# EAGLE design LNInterface (EAGLE 8.3.1)
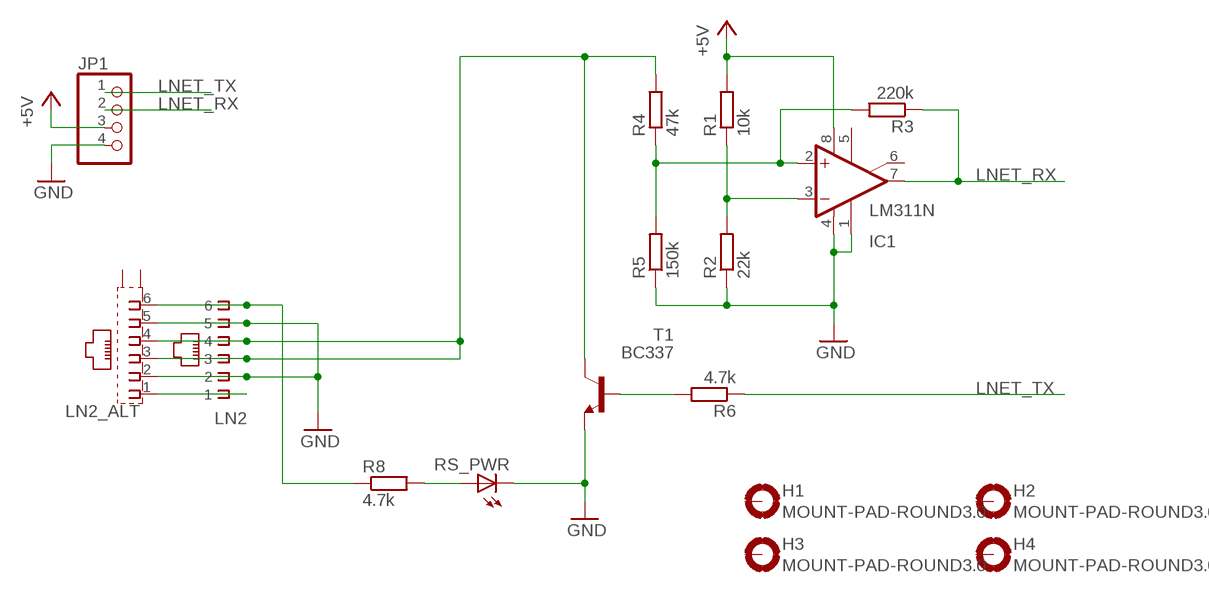
[diagram p0: schematic, sheet 1]

## Parts
H1  MOUNT-PAD-ROUND3.0  [3,0-PAD]
H2  MOUNT-PAD-ROUND3.0  [3,0-PAD]
H3  MOUNT-PAD-ROUND3.0  [3,0-PAD]
H4  MOUNT-PAD-ROUND3.0  [3,0-PAD]
IC1  LM311N  [DIL08]
JP1  PINHD-1X4  [1X04]
LN2  RJ11-6X  [RJ11-NO_SHIELD]
LN2_ALT  YH-55-10  [YH-55-10]
R1  10k  R-EU_0207/2V  [0207/2V]
R2  22k  R-EU_0207/2V  [0207/2V]
R3  220k  R-EU_0207/2V  [0207/2V]
R4  47k  R-EU_0207/2V  [0207/2V]
R5  150k  R-EU_0207/2V  [0207/2V]
R6  4.7k  R-EU_0207/2V  [0207/2V]
R8  4.7k  R-EU_0207/2V  [0207/2V]
RS_PWR  LED3MM  [LED3MM]
T1  BC337  [TO92]

## Nets
+5V: IC1.8(V+) JP1.3 R1.2
GND [power]: IC1.1(GND) IC1.4(V-) JP1.4 LN2.2 LN2.5 LN2_ALT.2 LN2_ALT.5 R2.1 R5.1 RS_PWR.K(C) T1.1(E)
LNET: LN2.3 LN2.4 LN2_ALT.3 LN2_ALT.4 R4.2 T1.3(C)
LNET_RX: IC1.7(OUT) JP1.2 R3.1
LNET_TX: JP1.1 R6.1
N$1: R6.2 T1.2(B)
N$3: IC1.3(-IN) R1.1 R2.2
N$5: IC1.2(+IN) R3.2 R4.1 R5.2
N$7 [power]: R8.2 RS_PWR.A
RAILSYNC_A [power]: LN2.6 LN2_ALT.6 R8.1
RAILSYNC_B [power]: LN2.1 LN2_ALT.1
Unconnected: H1.B3,0(MOUNT) H2.B3,0(MOUNT) H3.B3,0(MOUNT) H4.B3,0(MOUNT) IC1.5(ON) IC1.6(ON/STR) LN2_ALT.S1(S) LN2_ALT.S2(S)

## Library data of the parts
H1-H4 = holes:MOUNT-PAD-ROUND: MOUNTING PAD, round
IC1 = linear:LM311: COMPARATOR
JP1 = pinhead:PINHD-1X4: PIN HEADER
LN2 = con-tycoelectronics:RJ11: CORCOM Modular RJ Jacks No Shield Source: www.tycoelectronics.com .. ENG_DS_1654001_1099_RJ_L_0507.pdf; MPN: RJ11-6X; OC_FARNELL: unknown; OC_NEWARK: 16R6089
LN2_ALT = con-wenzhou-yihua:YH-55-10: RJ11 6 connects Source: YH-55-10.pdf; OC_FARNELL: unknown; OC_NEWARK: unknown
R1-R6 R8 = rcl:R-EU_: RESISTOR, European symbol
RS_PWR = led:LED: LED OSRAM: - CHIPLED LG R971, LG N971, LY N971, LG Q971, LY Q971, LO R971, LY R971 LH N974, LH R974 LS Q976, LO Q976, LY Q976 LO Q996 - Hyper CHIPLED LW Q18S LB Q993, LB Q99A, LB R99A - SideLED LS A670, LO A670, LY A670, LG A670, LP A670 LB A673, LV A673, LT A673, LW A673 LH A674 LY A675 LS A676, LA A676, LO A676, LY A676, LW A676 LS A679, LY A679, LG A679 - Hyper Micro SIDELED® LS Y876, LA Y876, LO Y876, LY Y876 LT Y87S - SmartLED LW L88C, LW L88S LB L89C, LB L89S, LG L890 LS L89K, LO L89K, LY L89K LS L896, LA L896, LO L896, LY L896 - TOPLED LS T670, LO T670, LY T670, LG T670, LP T670 LSG T670, LSP T670, LSY T670, LOP T670, LYG T670 LG T671, LOG T671, LSG T671 LB T673, LV T673, LT T673, LW T673 LH T674 LS T676, LA T676, LO T676, LY T676, LB T676, LH T676, LSB T676, LW T676 LB T67C, LV T67C, LT T67C, LS T67K, LO T67K, LY T67K, LW E67C LS E67B, LA E67B, LO E67B, LY E67B, LB E67C, LV E67C, LT E67C LW T67C LS T679, LY T679, LG T679 LS T770, LO T770, LY T770, LG T770, LP T770 LB T773, LV T773, LT T773, LW T773 LH T774 LS E675, LA E675, LY E675, LS T675 LS T776, LA T776, LO T776, LY T776, LB T776 LHGB T686 LT T68C, LB T68C - Hyper Mini TOPLED® LB M676 - Mini TOPLED Santana® LG M470 LS M47K, LO M47K, LY M47K Source: http://www.osram.convergy.de LUXEON: - LUMILED® LXK2-PW12-R00, LXK2-PW12-S00, LXK2-PW14-U00, LXK2-PW14-V00 LXK2-PM12-R00, LXK2-PM12-S00, LXK2-PM14-U00 LXK2-PE12-Q00, LXK2-PE12-R00, LXK2-PE12-S00, LXK2-PE14-T00, LXK2-PE14-U00 LXK2-PB12-K00, LXK2-PB12-L00, LXK2-PB12-M00, LXK2-PB14-N00, LXK2-PB14-P00, LXK2-PB14-Q00 LXK2-PR12-L00, LXK2-PR12-M00, LXK2-PR14-Q00, LXK2-PR14-R00 LXK2-PD12-Q00, LXK2-PD12-R00, LXK2-PD12-S00 LXK2-PH12-R00, LXK2-PH12-S00 LXK2-PL12-P00, LXK2-PL12-Q00, LXK2-PL12-R00 Source: www.luxeon.com KINGBRIGHT: KA-3528ASYC Source: www.kingbright.com
T1 = transistor:BC337: NPN TRANSISTOR

## Net classes
0 default: width 0.254 mm
1 power: width 1.016 mm

## Board
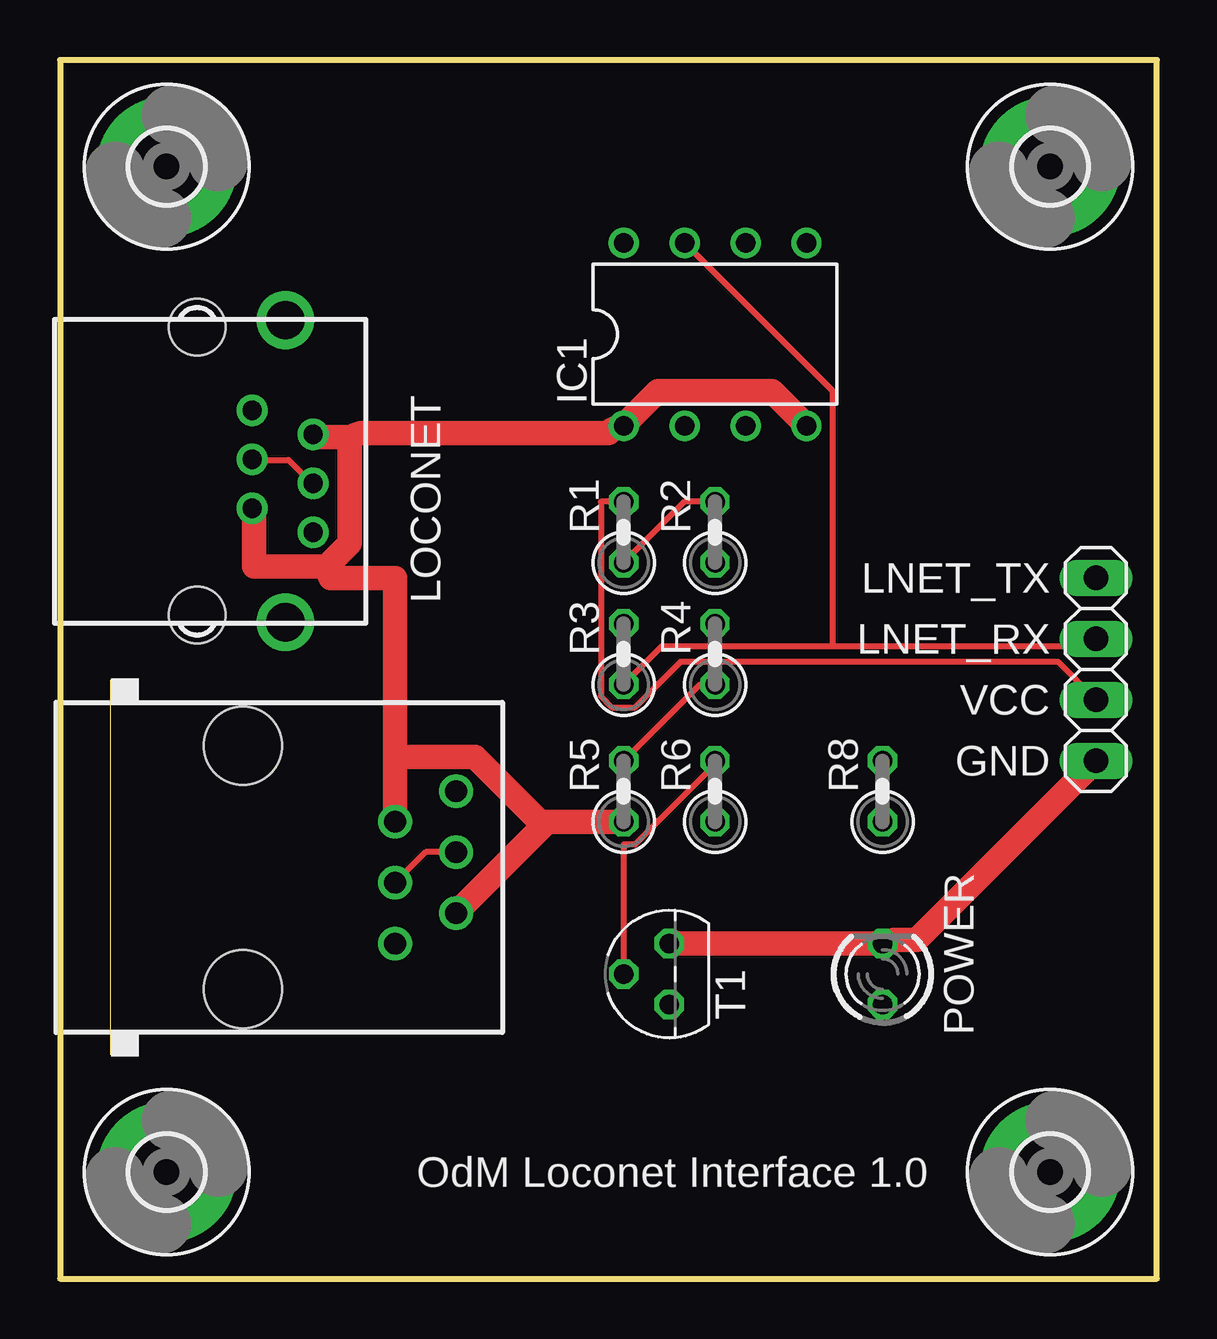
[diagram p1: board, top side]
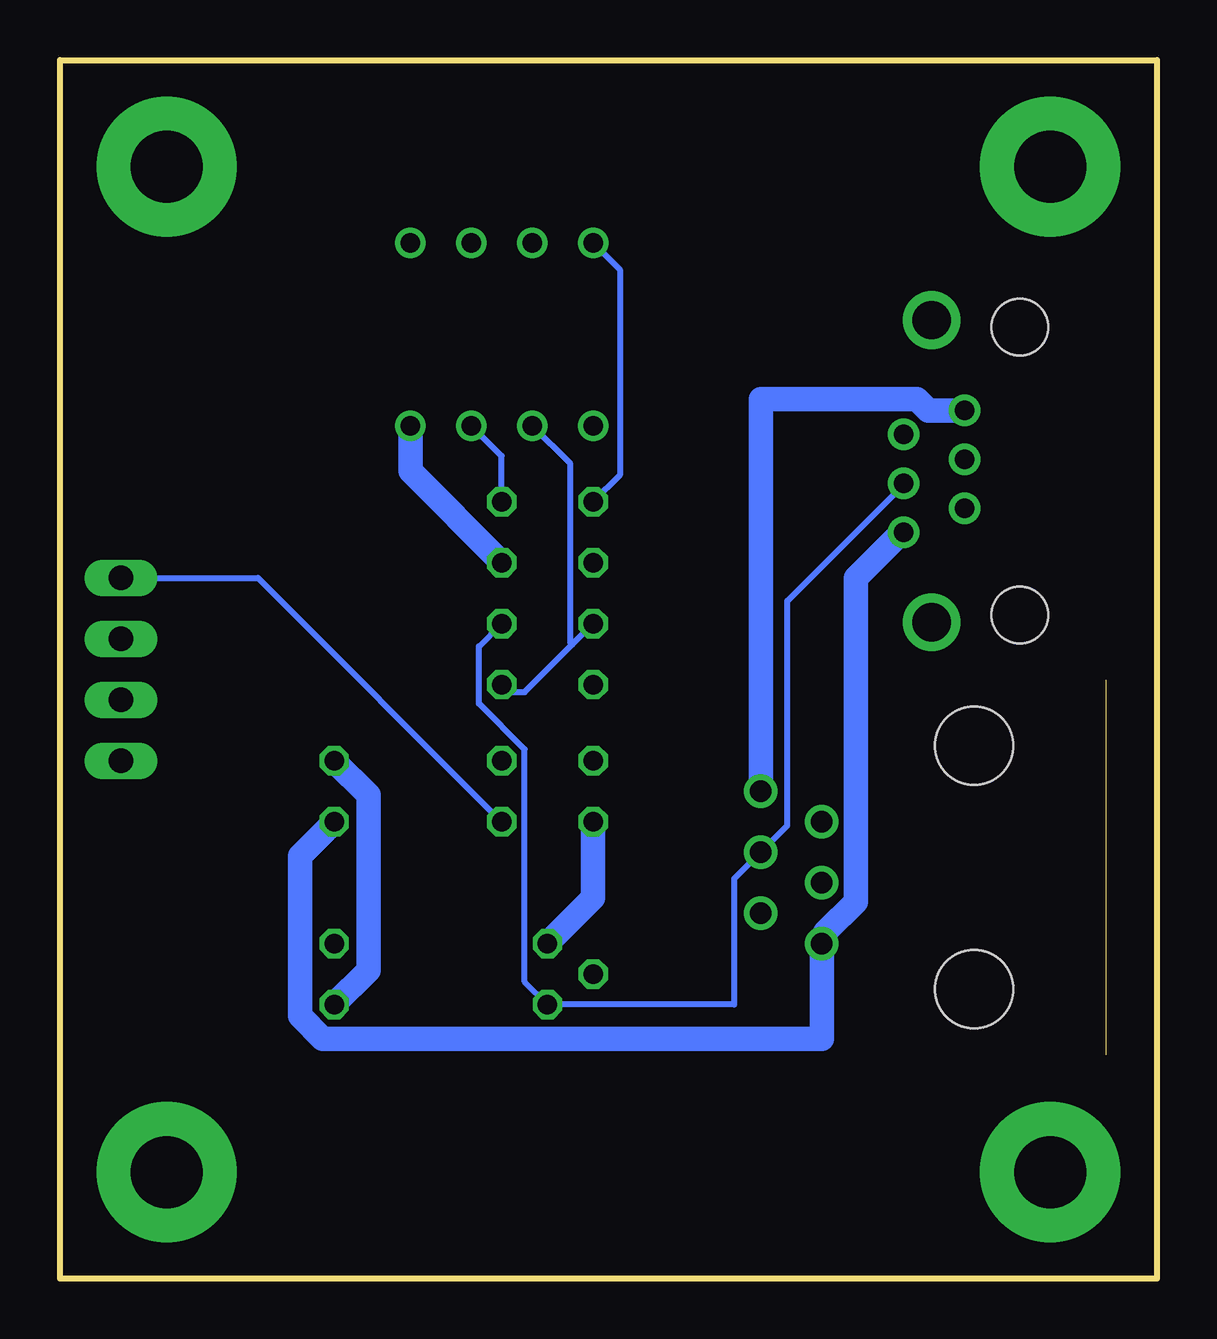
[diagram p2: board, bottom side, seen from below]

Size 45.72 x 50.8 mm. Coordinates in mm from the lower left corner, seen from the top.
Outline: 0,0 45.72,0 45.72,50.8 0,50.8 0,0
Copper layers (1*16): Top 0.035mm / dielectric 1.6mm / Bottom 0.035mm
Design rules "Elecrow_2-layer_PCB_eagle_rule *": minimum track width 10mil, minimum drill 12mil, track to track 10mil, track to pad 8mil, pad to pad 12mil, via to via 12mil, smd to smd 0mil, copper to edge 20mil, drill to drill 10mil, minimum pad ring 6mil, minimum via ring 6mil, stop-mask expansion 0mil, vias tented up to drill 100mil, thermal gap 10mil

### Footprints (pad centres in the part's own frame; a part is rotated, then mirrored left to right if it is on the bottom)
3,0-PAD = drill 3 pad 5.842: B3,0 0,0
DIL08 = drill 0.813 pad 1.27: 1 -3.81,-3.81; 2 -1.27,-3.81; 3 1.27,-3.81; 4 3.81,-3.81; 5 3.81,3.81; 6 1.27,3.81; 7 -1.27,3.81; 8 -3.81,3.81
1X04 = drill 1.016 long: 1 -3.81,0; 2 -1.27,0; 3 1.27,0; 4 3.81,0
RJ11-NO_SHIELD = drill 0.9 pad 1.4: 1 -3.175,8.89; 2 -1.905,6.35; 3 -0.635,8.89; 4 0.635,6.35; 5 1.905,8.89; 6 3.175,6.35 | hole 3.251: -5.08,0; 5.08,0
YH-55-10 = drill 0.8 pad 1.3: 1 -2.54,2.3; 2 -1.54,4.84; 3 -0.5,2.3; 4 0.5,4.84; 5 1.54,2.3; 6 2.54,4.84 | drill 1.6 pad 2.184: S1 -6.3,3.68; S2 6.3,3.68 | hole 2.36: -6,0; 6,0
0207/2V = drill 0.813 octagon: 1 -1.27,0; 2 1.27,0
LED3MM = drill 0.813 octagon: A -1.27,0; K 1.27,0
TO92 = drill 0.813 octagon: 1 1.27,0; 2 0,1.905; 3 -1.27,0

### Placement (x,y rotation side)
H1  4.45,4.45 0 top
H2  41.27,4.45 0 top
H3  4.45,46.35 0 top
H4  41.27,46.35 0 top
IC1  27.3,39.37 0 top
JP1  43.18,25.4 270 top
LN2  7.62,17.14 270 top
LN2_ALT  5.71,33.66 270 top
R1  23.5,31.11 90 top
R2  27.3,31.11 90 top
R3  23.5,26.04 90 top
R4  27.3,26.04 90 top
R5  23.5,20.32 90 top
R6  27.3,20.32 90 top
R8  34.29,20.32 90 top
RS_PWR  34.29,12.7 90 top
T1  25.4,12.7 90 top

### Tracks (layer width: path | path; a pad name or v marks a point on that pad's centre or on a via)
+5V
  Top 0.254: JP1.3 41.59,25.72 25.88,25.72 23.97,23.81 23.02,23.81 22.54,24.29 22.54,32.38 R1.2
  Bottom 0.254: R1.2 22.38,33.5 22.38,42.07 IC1.8
GND
  Top 1.016: T1.1 RS_PWR.K 34.77,14.13 35.72,14.13 JP1.4 | 20.16,18.89 20.32,19.05 R5.1 | 20.16,18.89 LN2.5 | IC1.4 29.69,36.99 24.92,36.99 IC1.1 23.02,35.4 22.86,35.24 12.54,35.24 12.06,35.08 | 11.11,29.69 8.1,29.69 8.1,32.07 LN2_ALT.5 | 11.11,29.69 12.06,30.64 12.06,35.08 | 12.06,35.08 10.64,35.08 LN2_ALT.2 | 13.97,21.75 13.97,29.21 11.27,29.21 11.11,29.69 | 13.97,21.75 LN2.2 | 20.16,18.89 17.3,21.75 13.97,21.75
  Bottom 1.016: T1.1 23.5,15.88 R5.1 | R2.1 31.11,33.66 IC1.4
LNET
  Top 0.254: LN2_ALT.4 10.48,33.18 9.53,34.13 8.1,34.13 LN2_ALT.3 | LN2.4 15.24,17.78 LN2.3
  Bottom 0.254: R4.2 28.26,26.35 28.26,23.97 26.35,22.07 26.35,12.38 T1.3 17.62,11.43 17.62,16.67 LN2.3 15.4,18.89 15.4,28.26 10.64,33.02 LN2_ALT.4
LNET_RX
  Top 0.254: R3.1 25.08,26.35 32.23,26.35 | 32.23,26.35 42.86,26.35 JP1.2 | IC1.7 32.23,36.99 32.23,26.35
LNET_TX
  Bottom 0.254: R6.1 37.47,29.21 JP1.1
N$1
  Top 0.254: T1.2 23.5,18.1 23.97,18.1 27.3,21.43 R6.2
N$3
  Top 0.254: R1.1 26.04,32.38 R2.2
  Bottom 0.254: IC1.3 27.3,34.29 R2.2
N$5
  Top 0.254: R5.2 26.67,24.77 R4.1
  Bottom 0.254: 24.37,26.43 26.35,24.45 27.3,24.45 R4.1 | 24.37,26.43 R3.2 | IC1.2 24.45,33.97 24.45,26.51 24.37,26.43
N$7
  Bottom 1.016: RS_PWR.A 32.86,12.86 32.86,20.16 R8.2
RAILSYNC_A
  Bottom 1.016: R8.1 35.72,17.62 35.72,10.95 34.77,10 13.97,10 LN2.6 13.81,14.45 12.54,15.72 12.54,29.21 10.64,31.11 LN2_ALT.6
RAILSYNC_B
  Bottom 1.016: LN2_ALT.1 9.53,36.2 10,36.67 16.51,36.67 LN2.1

### Text on the board
tNames: LOCONET | LNET_TX | LNET_RX | VCC | GND | POWER | OdM Loconet Interface 1.0